# EAGLE design Nch_Full_Bridge (EAGLE 6.2)
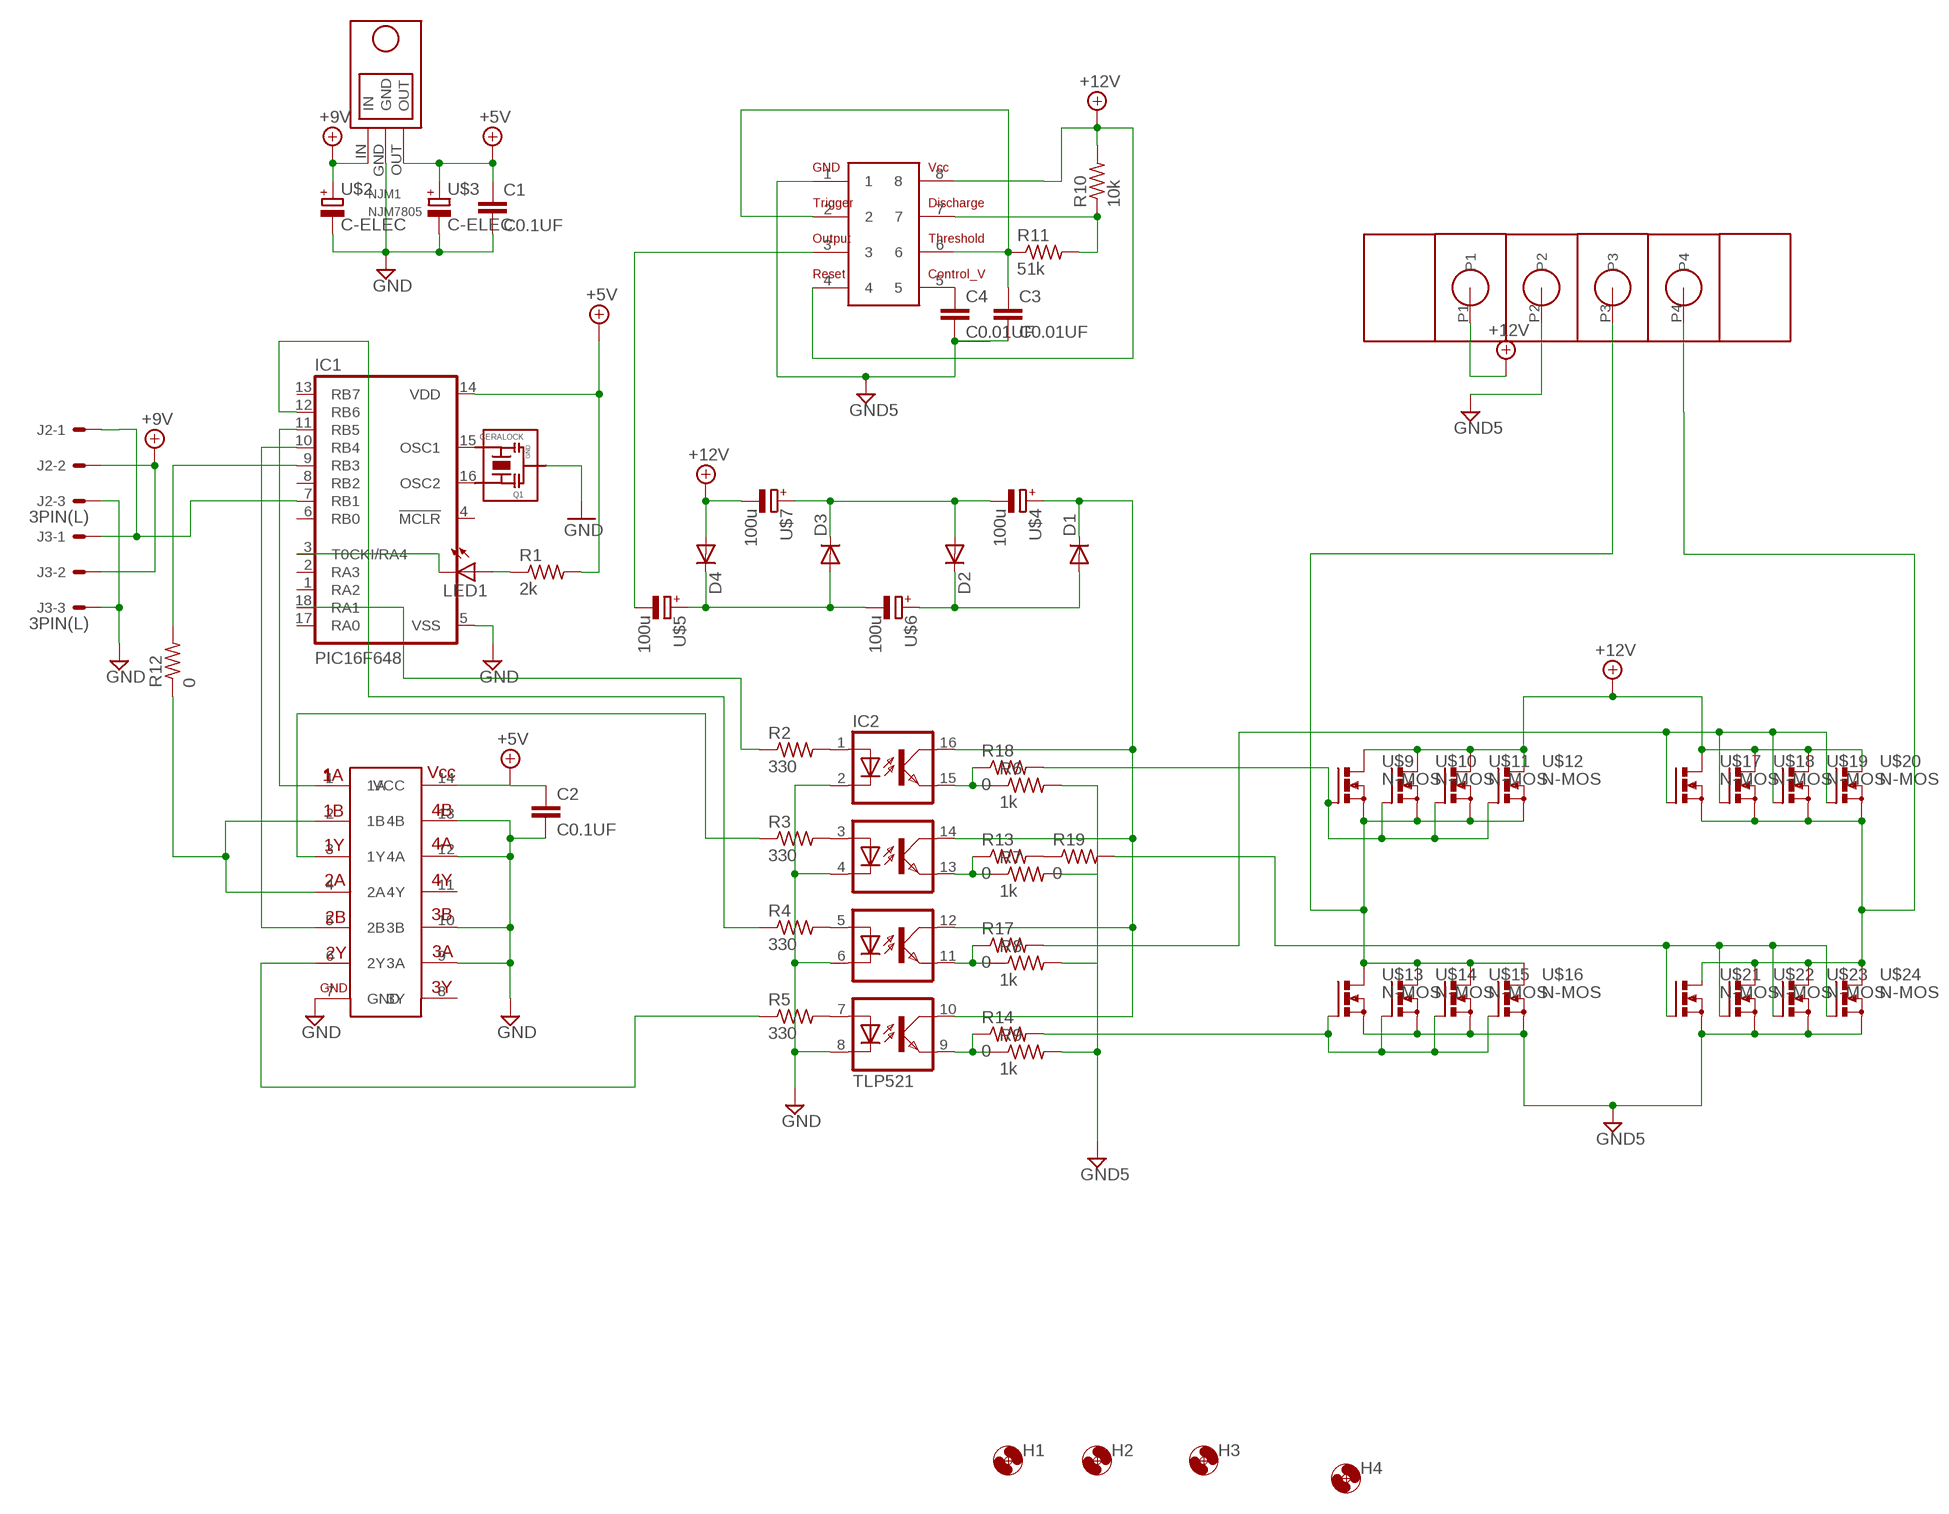
[diagram p0: schematic, sheet 1]

## Parts
C1  C0.1UF  [C0.1UF]
C2  C0.1UF  [C0.1UF]
C3  C0.01UF  C0.1UF  [C0.1UF]
C4  C0.01UF  C0.1UF  [C0.1UF]
D1  DIODE7.5  [DIODE7.5]
D2  DIODE7.5  [DIODE7.5]
D3  DIODE7.5  [DIODE7.5]
D4  DIODE7.5  [DIODE7.5]
H1  HOLE3.3M3BOLT  [HOLE3.3]
H2  HOLE3.3M3BOLT  [HOLE3.3]
H3  HOLE3.3M3BOLT  [HOLE3.3]
H4  HOLE3.3M3BOLT  [HOLE3.3]
IC1  PIC16F648  [DIL18]
IC2  TLP521  [DIL16]
J2  3PIN(L)  [3PL]
J3  3PIN(L)  [3PL]
LED1  LED  [LED5MM]
NJM1  NJM7805  [NJM7805]
Q1  CERALOCK  [CERALOCK]
R1  2k  R-  [0207/10]
R2  330  R-  [0207/10]
R3  330  R-  [0207/10]
R4  330  R-  [0207/10]
R5  330  R-  [0207/10]
R6  1k  R-  [0207/10]
R7  1k  R-  [0207/10]
R8  1k  R-  [0207/10]
R9  1k  R-  [0207/10]
R10  10k  R-  [0207/10]
R11  51k  R-  [0207/10]
R12  0  R-  [0207/10]
R13  0  R-  [0207/10]
R14  0  R-  [0207/10]
R17  0  R-  [0207/10]
R18  0  R-  [0207/10]
R19  0  R-  [0207/10]
U$1  HD74HC08  [DIL14]
U$2  C-ELEC  [C-6MM]
U$3  C-ELEC  [C-6MM]
U$4  100u  C-ELEC  [C-6MM]
U$5  100u  C-ELEC  [C-6MM]
U$6  100u  C-ELEC  [C-6MM]
U$7  100u  C-ELEC  [C-6MM]
U$8  NE555N  [DIL08]
U$9  N-MOS  [TO220BV]
U$10  N-MOS  [TO220BV]
U$11  N-MOS  [TO220BV]
U$12  N-MOS  [TO220BV]
U$13  N-MOS  [TO220BV]
U$14  N-MOS  [TO220BV]
U$15  N-MOS  [TO220BV]
U$16  N-MOS  [TO220BV]
U$17  N-MOS  [TO220BV]
U$18  N-MOS  [TO220BV]
U$19  N-MOS  [TO220BV]
U$20  N-MOS  [TO220BV]
U$21  N-MOS  [TO220BV]
U$22  N-MOS  [TO220BV]
U$23  N-MOS  [TO220BV]
U$24  N-MOS  [TO220BV]
U$25  BP341L  [BP341L]

## Nets
+5V: C1.1 C2.1 IC1.14(VDD) NJM1.OUT R1.2 U$1.14(VCC) U$3.+
+9V: J2.2 J3.2 NJM1.IN U$2.+
+12V: D4.PA(A) R10.2 U$7.- U$8.4 U$8.8 U$9.D U$10.D U$11.D U$12.D U$17.D U$18.D U$19.D U$25.P1
GND: C1.2 C2.2 IC1.5(VSS) IC2.2(C0) IC2.4(C1) IC2.6(C2) IC2.8(C3) J2.3 J3.3 NJM1.GND Q1.P$2 U$1.7(GND) U$1.9(3A) U$1.10(3B) U$1.12(4A) U$1.13(4B) U$2.- U$3.-
GND5: C3.2 C4.2 R6.2 R7.2 R8.2 R9.2 U$8.1 U$13.S U$14.S U$15.S U$16.S U$21.S U$22.S U$23.S U$24.S U$25.P2
N$1: IC1.16(OSC2) Q1.P$1
N$2: IC1.15(OSC1) Q1.P$3
N$3: IC1.3(T0CKI/RA4) LED1.K(C)
N$4: LED1.A R1.1
N$5: IC2.7(A3) R5.2
N$6: IC1.9(RB3) R12.2
N$7: IC1.18(RA1) R2.1
N$9: IC1.12(RB6) R4.1
N$10: R3.1 U$1.3(1Y)
N$11: R5.1 U$1.6(2Y)
N$12: R12.1 U$1.2(1B) U$1.4(2A)
N$13: IC1.11(RB5) U$1.1(1A)
N$14: IC1.10(RB4) U$1.5(2B)
N$15: IC2.1(A0) R2.2
N$16: IC2.3(A1) R3.2
N$17: IC2.5(A2) R4.2
N$18: R10.1 R11.2 U$8.7
N$19: D1.PK(C) IC2.10(COL3) IC2.12(COL2) IC2.14(COL1) IC2.16(COL0) U$4.+
N$20: D1.PA(A) D2.PK(C) U$6.+
N$21: D2.PA(A) D3.PK(C) U$4.- U$7.+
N$22: C3.1 R11.1 U$8.2 U$8.6
N$23: D3.PA(A) D4.PK(C) U$5.+ U$6.-
N$24: C4.1 U$8.5
N$26: U$5.- U$8.3
N$27: R18.2 U$9.G U$10.G U$11.G U$12.G
N$28: R19.2 U$21.G U$22.G U$23.G U$24.G
N$29: R17.2 U$17.G U$18.G U$19.G U$20.G
N$30: R14.2 U$13.G U$14.G U$15.G U$16.G
N$31: IC2.11(EMIT2) R8.1 R17.1
N$32: U$9.S U$10.S U$11.S U$12.S U$13.D U$14.D U$15.D U$16.D U$25.P3
N$33: IC1.7(RB1) J2.1 J3.1
N$34: IC2.13(EMIT1) R7.1 R13.1
N$35: IC2.9(EMIT3) R9.1 R14.1
N$38: IC2.15(EMIT0) R6.1 R18.1
N$39: U$17.S U$18.S U$19.S U$20.S U$22.D U$23.D U$24.D U$25.P4
N$40: R13.2 R19.1
Unconnected: IC1.1(RA2) IC1.2(RA3) IC1.4(!MCLR) IC1.6(RB0) IC1.8(RB2) IC1.13(RB7) IC1.17(RA0) U$1.8(3Y) U$1.11(4Y) U$20.D U$21.D

## Library data of the parts
C1-C4 = FP-21T for MITS:C0.1UF
D1-D4 = diode:DIODE7.5
H1-H4 = FP-21T for MITS:HOLE3.3
IC1 = FP-21T for MITS:PIC16F648
IC2 = FP-21T for MITS:TLP521
J2 J3 = my_connector:3PIN(L)
LED1 = my_led:LED: LED
NJM1 = My_NJM7805:NJM7805
Q1 = FP-21T for MITS:CERALOCK: CERALOCK CERAMIC RESONATOR
R1-R14 R17-R19 = My_rcl:R-: Resistor
U$1 = IC:HD74HC08
U$2-U$7 = My_rcl:C-ELEC
U$8 = IC:NE555N
U$9-U$24 = FET_kai:N-MOS
U$25 = BP341_4PIN:BP341L

## Board
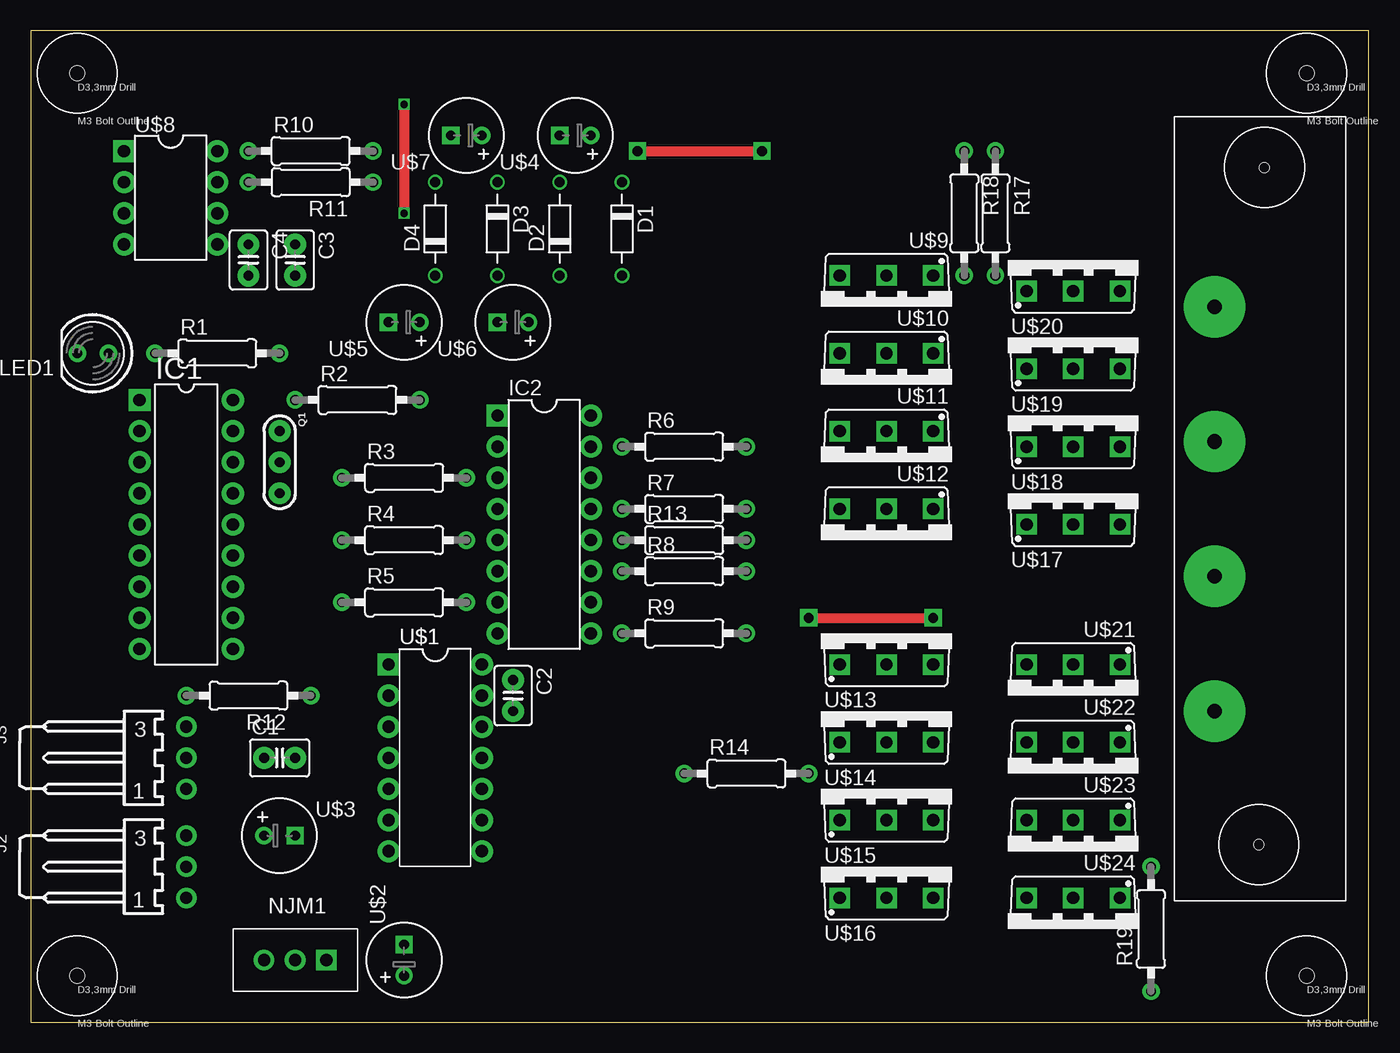
[diagram p1: board, top side]
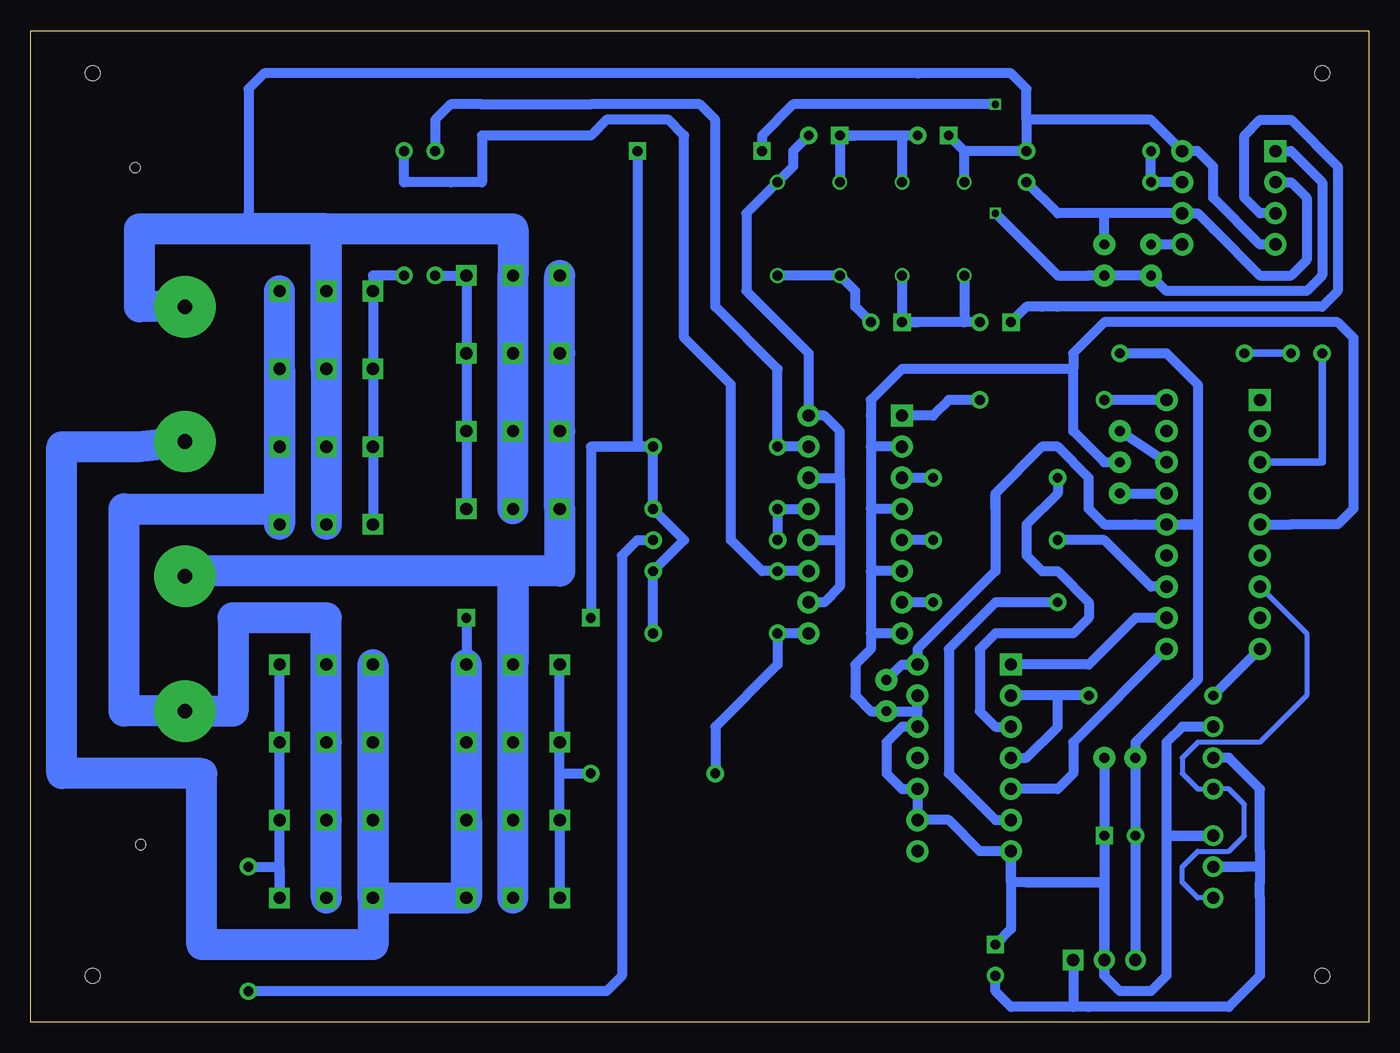
[diagram p2: board, bottom side, seen from below]

Size 109.2 x 80.95 mm. Coordinates in mm from the lower left corner, seen from the top.
Outline: 0,0 109.2,0 109.2,80.95 0,80.95 0,0
Copper layers (1*16): Top 0.035mm / dielectric 1.5mm / Bottom 0.035mm
Design rules: minimum track width 0.15mm, minimum drill 0.3mm, track to track 0.15mm, track to pad 0.15mm, pad to pad 0.15mm, via to via 0.15mm, smd to smd 0.15mm, copper to edge 0.7mm, drill to drill 0.45mm, minimum pad ring 0.15mm, minimum via ring 0.15mm, stop-mask expansion 4mil, vias tented up to drill 0mil, thermal gap 0.15mm

### Footprints (pad centres in the part's own frame; a part is rotated, then mirrored left to right if it is on the bottom)
C0.1UF = drill 0.8 pad 1.778: 1 -1.27,0; 2 1.27,0
DIODE7.5 = drill 0.8: PA 3.81,0; PK -3.81,0
HOLE3.3 = hole 1.2: 0,0
DIL18 = drill 1 pad 1.8 square: 1 -10.16,-3.81 | drill 1 pad 1.8: 2 -7.62,-3.81; 3 -5.08,-3.81; 4 -2.54,-3.81; 5 0,-3.81; 6 2.54,-3.81; 7 5.08,-3.81; 8 7.62,-3.81; 9 10.16,-3.81; 10 10.16,3.81; 11 7.62,3.81; 12 5.08,3.81; 13 2.54,3.81; 14 0,3.81; 15 -2.54,3.81; 16 -5.08,3.81; 17 -7.62,3.81; 18 -10.16,3.81
DIL16 = drill 1 pad 1.8 square: 1 -8.89,-3.81 | drill 1 pad 1.8: 2 -6.35,-3.81; 3 -3.81,-3.81; 4 -1.27,-3.81; 5 1.27,-3.81; 6 3.81,-3.81; 7 6.35,-3.81; 8 8.89,-3.81; 9 8.89,3.81; 10 6.35,3.81; 11 3.81,3.81; 12 1.27,3.81; 13 -1.27,3.81; 14 -3.81,3.81; 15 -6.35,3.81; 16 -8.89,3.81
3PL = drill 1 pad 1.676: 1 -2.54,-7.62; 2 0,-7.62; 3 2.54,-7.62
LED5MM = drill 0.8 pad 1.422: A -1.27,0; K 1.27,0
NJM7805 = drill 1 pad 1.676: GND 0,0; OUT 2.54,0 | drill 1 pad 1.676 square: IN -2.54,0
CERALOCK = drill 0.8 pad 1.778: P$1 -2.54,0; P$2 0,0; P$3 2.54,0
0207/10 = drill 0.8 pad 1.422: 1 -5.08,0; 2 5.08,0
DIL14 = drill 1 pad 1.8 square: 1 -7.62,-3.81 | drill 1 pad 1.8: 2 -5.08,-3.81; 3 -2.54,-3.81; 4 0,-3.81; 5 2.54,-3.81; 6 5.08,-3.81; 7 7.62,-3.81; 8 7.62,3.81; 9 5.08,3.81; 10 2.54,3.81; 11 0,3.81; 12 -2.54,3.81; 13 -5.08,3.81; 14 -7.62,3.81
C-6MM = drill 0.8 pad 1.422: + -1.27,0 | drill 0.8 pad 1.422 square: - 1.27,0
DIL08 = drill 1 pad 1.8 square: 1 -3.81,-3.81 | drill 1 pad 1.8: 2 -1.27,-3.81; 3 1.27,-3.81; 4 3.81,-3.81; 5 3.81,3.81; 6 1.27,3.81; 7 -1.27,3.81; 8 -3.81,3.81
TO220BV = drill 1 pad 1.676 square: D 0,0; G -3.81,0; S 3.81,0
BP341L = drill 1.2 pad 5: P1 -16.5,-3.7; P2 -5.5,-3.7; P3 5.5,-3.7; P4 16.5,-3.7 | hole 0.8: -27.87,0.37; 27.4,-0.1

### Placement (x,y rotation side)
C1  20.32,21.59 0 top
C2  39.37,26.67 270 top
C3  21.59,62.23 270 top
C4  17.78,62.23 270 top
D1  48.26,64.77 270 top
D2  43.18,64.77 90 top
D3  38.1,64.77 270 top
D4  33.02,64.77 90 top
H1  3.81,3.81 0 top
H2  3.81,77.47 0 top
H3  104.14,3.81 0 top
H4  104.14,77.47 0 top
IC1  12.7,40.64 270 top
IC2  41.91,40.64 270 top
J2  5.08,12.7 90 top
J3  5.08,21.59 90 top
LED1  5.08,54.61 180 top
NJM1  21.59,5.08 180 top
Q1  20.32,45.72 270 top
R1  15.24,54.61 0 top
R2  26.67,50.8 0 top
R3  30.48,44.45 0 top
R4  30.48,39.37 0 top
R5  30.48,34.29 0 top
R6  53.34,46.99 0 top
R7  53.34,41.91 0 top
R8  53.34,36.83 0 top
R9  53.34,31.75 0 top
R10  22.86,71.12 0 top
R11  22.86,68.58 180 top
R12  17.78,26.67 180 top
R13  53.34,39.37 0 top
R14  58.42,20.32 0 top
R17  78.74,66.04 270 top
R18  76.2,66.04 270 top
R19  91.44,7.62 90 top
U$1  33.02,21.59 270 top
U$2  30.48,5.08 90 top
U$3  20.32,15.24 0 top
U$4  44.45,72.39 180 top
U$5  30.48,57.15 180 top
U$6  39.37,57.15 180 top
U$7  35.56,72.39 180 top
U$8  11.43,67.31 270 top
U$9  69.85,60.96 180 top
U$10  69.85,54.61 180 top
U$11  69.85,48.26 180 top
U$12  69.85,41.91 180 top
U$13  69.85,29.21 0 top
U$14  69.85,22.86 0 top
U$15  69.85,16.51 0 top
U$16  69.85,10.16 0 top
U$17  85.09,40.64 0 top
U$18  85.09,46.99 0 top
U$19  85.09,53.34 0 top
U$20  85.09,59.69 0 top
U$21  85.09,29.21 180 top
U$22  85.09,22.86 180 top
U$23  85.09,16.51 180 top
U$24  85.09,10.16 180 top
U$25  100.33,41.91 270 top

### Tracks (layer width: path | path; a pad name or v marks a point on that pad's centre or on a via)
+5V
  Bottom 0.61: 15.24,40.64 IC1.14
  Bottom 0.813: R1.2 16.51,54.61 13.97,52.07 13.97,40.64 | 13.97,40.64 15.24,40.64 | 15.24,40.64 IC1.14 19.05,40.64 21.59,40.64 22.86,41.91 | 15.24,40.64 13.97,40.64 | 13.97,40.64 13.97,27.94 19.05,22.86 C1.1 U$3.+ 19.05,7.62 NJM1.OUT | 22.86,41.91 22.86,44.45 | 22.86,44.45 25.4,46.99 | 25.4,46.99 26.67,46.99 | 22.86,41.91 22.86,44.45 | 22.86,44.45 25.4,46.99 | 25.4,46.99 26.67,46.99 | 30.48,41.91 30.48,43.18 | 30.48,43.18 26.67,46.99 | 26.67,46.99 30.48,43.18 | 30.48,43.18 30.48,36.83 36.83,30.48 U$1.14 38.1,29.21 C2.1
+9V
  Bottom 0.813: 10.16,12.7 J2.2 10.16,12.7 | 8.89,13.97 8.89,19.05 11.43,21.59 J3.2 | 8.89,13.97 8.89,12.7 | 8.89,12.7 8.89,11.43 8.89,10.16 8.89,3.81 11.43,1.27 22.86,1.27 24.13,1.27 | 8.89,13.97 8.89,12.7 | 8.89,12.7 10.16,12.7 | NJM1.IN 24.13,1.27 | 24.13,1.27 29.21,1.27 30.48,2.54 U$2.+
+12V
  Bottom 0.813: U$9.D 69.85,64.77 85.09,64.77 91.44,64.77 91.44,66.04 91.44,76.2 90.17,77.47 36.83,77.47 29.21,77.47 27.94,76.2 27.94,73.66 | 27.94,73.66 R10.2 33.02,71.12 | 27.94,73.66 17.78,73.66 U$8.8 13.97,71.12 12.7,69.85 12.7,67.31 8.89,63.5 U$8.4 | D4.PA 33.02,69.85 33.02,71.12 | 33.02,71.12 U$7.-
  Bottom 2.54: U$12.D U$11.D U$10.D U$9.D 69.85,64.77 85.09,64.77 | U$19.D U$18.D | U$18.D U$17.D U$18.D | U$19.D U$18.D | U$25.P1 100.33,58.41 100.33,64.77 91.44,64.77 | 91.44,64.77 85.09,64.77 | 85.09,64.77 U$19.D | U$19.D 85.09,64.77 | 85.09,64.77 91.44,64.77 | 91.44,64.77 85.09,64.77
GND
  Bottom 0.813: IC1.5 6.35,40.64 2.54,40.64 1.27,41.91 1.27,55.88 2.54,57.15 21.59,57.15 24.13,54.61 24.13,53.34 | Q1.P$2 21.59,45.72 24.13,48.26 24.13,53.34 | 40.64,46.99 40.64,49.53 40.64,50.8 38.1,53.34 24.13,53.34 | 40.64,46.99 40.64,41.91 | 40.64,41.91 40.64,36.83 | 40.64,36.83 40.64,31.75 | IC2.8 40.64,31.75 | IC2.6 40.64,36.83 | IC2.4 40.64,41.91 | IC2.2 40.64,46.99 | 27.94,11.43 21.59,11.43 | J3.3 15.24,24.13 16.51,22.86 16.51,15.24 | 16.51,15.24 J2.3 16.51,15.24 | 16.51,15.24 16.51,3.81 17.78,2.54 20.32,2.54 21.59,3.81 | U$1.7 29.21,12.7 | 29.21,12.7 U$1.7 | U$1.7 31.75,13.97 34.29,16.51 U$1.9 U$1.10 38.1,19.05 39.37,20.32 39.37,22.86 38.1,24.13 U$1.12 36.83,25.4 | 40.64,31.75 40.64,30.48 41.91,29.21 41.91,26.67 40.64,25.4 C2.2 36.83,25.4 | 36.83,25.4 U$1.13 | 27.94,11.43 29.21,11.43 | 29.21,11.43 29.21,12.7 | 27.94,11.43 29.21,11.43 | 29.21,11.43 29.21,7.62 | 29.21,7.62 U$2.- | 29.21,12.7 29.21,7.62 | 29.21,7.62 U$2.- | 21.59,3.81 NJM1.GND | NJM1.GND 21.59,7.62 | 21.59,7.62 21.59,11.43 | 21.59,3.81 NJM1.GND | NJM1.GND 21.59,7.62 | 21.59,7.62 21.59,11.43 | 21.59,11.43 21.59,7.62 | 21.59,7.62 21.59,11.43 | C1.2 U$3.- 21.59,11.43 | 21.59,11.43 29.21,11.43 | 29.21,11.43 29.21,7.62 | 29.21,7.62 U$2.- | 21.59,11.43 21.59,8.89 | 21.59,8.89 NJM1.GND | NJM1.GND 21.59,3.81 | NJM1.GND 21.59,8.89
GND5  (via drill 0.6, 0.8 pad 1.42)
  Top 0.813: v49.53,71.12 v59.69,71.12 | v63.5,33.02 v73.66,33.02 | v30.48,74.93 v30.48,66.04
  Bottom 0.813: R8.2 R9.2 R8.2 | R8.2 55.88,39.37 | 55.88,39.37 R7.2 | R7.2 R6.2 | 63.5,46.99 59.69,46.99 | 59.69,46.99 R6.2 | C4.2 C3.2 | C4.2 C3.2 | U$8.1 6.35,71.12 3.81,68.58 3.81,60.96 5.08,59.69 16.51,59.69 C4.2 | C3.2 22.86,60.96 25.4,60.96 v30.48,66.04 | v30.48,74.93 46.99,74.93 49.53,72.39 v49.53,71.12 | R8.2 55.88,39.37 | 55.88,39.37 R7.2 | R7.2 R6.2 | R6.2 59.69,46.99 | 59.69,46.99 63.5,46.99 | 63.5,46.99 v63.5,33.02 | v59.69,71.12 59.69,46.99 | v73.66,33.02 U$13.S
  Bottom 2.54: U$16.S U$15.S | U$15.S U$14.S | U$14.S U$13.S U$14.S | U$15.S U$16.S | U$24.S U$23.S U$22.S U$21.S | U$21.S U$24.S | U$24.S U$16.S | U$21.S 81.28,6.35 95.25,6.35 95.25,20.32 106.68,20.32 106.68,46.99 100.44,46.99 U$25.P2
N$1
  Bottom 0.813: IC1.16 Q1.P$1
N$2
  Bottom 0.813: Q1.P$3 IC1.15
N$3
  Bottom 0.61: IC1.3 6.35,45.72 3.81,45.72 LED1.K
N$4
  Bottom 0.61: LED1.A R1.1
N$5
  Bottom 0.813: R5.2 IC2.7
N$6
  Bottom 0.813: IC1.9 R12.2
N$7
  Bottom 0.813: IC1.18 19.05,50.8 20.32,50.8 R2.1
N$9
  Bottom 0.813: IC1.12 17.78,35.56 21.59,39.37 R4.1
N$10
  Bottom 0.813: R3.1 25.4,43.18 27.94,40.64 27.94,38.1 26.67,36.83 25.4,36.83 22.86,34.29 22.86,33.02 24.13,31.75 30.48,31.75 31.75,30.48 31.75,25.4 30.48,24.13 U$1.3
N$11
  Bottom 0.813: R5.1 30.48,34.29 34.29,30.48 34.29,20.32 30.48,16.51 U$1.6
N$12
  Bottom 0.813: R12.1 25.4,26.67 | 25.4,26.67 U$1.2 | U$1.4 27.94,21.59 25.4,24.13 25.4,26.67
N$13
  Bottom 0.813: IC1.11 19.05,33.02 22.86,29.21 U$1.1
N$14
  Bottom 0.813: IC1.10 24.13,22.86 24.13,20.32 25.4,19.05 U$1.5
N$15
  Bottom 0.813: R2.2 34.29,50.8 35.56,49.53 IC2.1
N$16
  Bottom 0.813: R3.2 36.83,44.45 IC2.3
N$17
  Bottom 0.813: R4.2 IC2.5
N$18
  Bottom 0.813: U$8.7 R11.2 R10.1
N$19
  Bottom 0.813: 43.18,44.45 43.18,39.37 | IC2.14 43.18,44.45 | 43.18,39.37 IC2.12 43.18,39.37 | 43.18,44.45 43.18,48.26 44.45,49.53 IC2.16 45.72,54.61 50.8,59.69 50.8,66.04 D1.PK 46.99,69.85 46.99,71.12 U$4.+ | 43.18,39.37 43.18,35.56 44.45,34.29 IC2.10
N$20
  Bottom 0.813: D1.PA D2.PK 41.91,59.69 41.91,58.42 | 41.91,58.42 U$6.+ 41.91,58.42
N$21
  Bottom 0.813: 38.1,72.39 U$7.+ 38.1,72.39 | 38.1,72.39 41.91,72.39 | 41.91,72.39 U$4.- | U$4.- 41.91,72.39 | 38.1,72.39 D3.PK | 41.91,72.39 U$4.- | U$4.- D2.PA
N$22
  Bottom 0.813: U$8.2 6.35,68.58 5.08,67.31 5.08,62.23 6.35,60.96 8.89,60.96 12.7,64.77 13.97,66.04 U$8.6 21.59,66.04 | 21.59,66.04 25.4,66.04 R11.1 | C3.1 21.59,66.04
N$23
  Bottom 0.813: U$5.+ 33.02,57.15 | 33.02,57.15 36.83,57.15 | 36.83,57.15 U$6.- | U$6.- 36.83,57.15 | D4.PK 33.02,57.15 | D3.PA U$6.-
N$24
  Bottom 0.813: U$8.5 C4.1
N$26
  Bottom 0.813: U$8.3 8.89,66.04 10.16,67.31 10.16,72.39 8.89,73.66 6.35,73.66 2.54,69.85 2.54,59.69 3.81,58.42 25.4,58.42 26.67,58.42 27.94,58.42 U$5.-
N$27
  Bottom 0.813: R18.2 U$9.G U$10.G U$11.G U$12.G
N$28
  Bottom 0.813: R19.2 88.9,12.7 | 88.9,12.7 U$24.G 88.9,12.7 | 88.9,12.7 U$23.G U$22.G U$21.G
N$29
  Bottom 0.813: R17.2 81.28,60.96 U$20.G U$19.G U$18.G U$17.G
N$30
  Bottom 0.813: U$15.G 66.04,20.32 | 66.04,20.32 U$14.G U$13.G | U$15.G U$16.G | U$15.G 66.04,20.32 | 66.04,20.32 R14.2
N$31
  Bottom 0.813: IC2.11 R8.1 49.53,36.83 | 49.53,36.83 52.07,39.37 | R17.1 78.74,69.85 78.74,68.58 74.93,68.58 72.39,68.58 72.39,72.39 63.5,72.39 62.23,73.66 57.15,73.66 55.88,72.39 55.88,55.88 52.07,52.07 52.07,44.45 52.07,39.37 | 52.07,39.37 49.53,36.83 | 49.53,36.83 52.07,39.37
N$32
  Bottom 2.54: U$16.D U$15.D U$14.D 69.85,27.94 U$13.D | U$9.S U$10.S U$11.S U$12.S 66.04,36.83 69.85,36.83 | 69.85,36.83 U$13.D | U$13.D 69.85,36.83 | 69.85,36.83 94.94,36.83 U$25.P3
N$33
  Bottom 0.406: IC1.7 6.35,33.02 5.08,31.75 5.08,26.67 8.89,22.86 13.97,22.86 15.24,21.59 15.24,20.32 13.97,19.05 J3.1 11.43,19.05 10.16,17.78 10.16,15.24 11.43,13.97 13.97,13.97 15.24,12.7 15.24,11.43 13.97,10.16 J2.1
N$34
  Bottom 0.813: IC2.13 R7.1 48.26,40.64 R13.1
N$35
  Bottom 0.813: IC2.9 R9.1 48.26,29.21 53.34,24.13 R14.1
N$38
  Bottom 0.813: IC2.15 R6.1 48.26,53.34 53.34,58.42 53.34,72.39 53.34,73.66 54.61,74.93 63.5,74.93 72.39,74.93 74.93,74.93 76.2,73.66 R18.1
N$39
  Bottom 2.54: U$24.D U$23.D U$22.D 85.09,33.02 92.71,33.02 92.71,25.4 U$25.P4 101.6,25.41 101.6,41.91 88.9,41.91 | 88.9,41.91 U$17.S | 88.9,41.91 U$18.S | U$18.S U$19.S | U$19.S U$20.S | U$19.S U$18.S | U$18.S 88.9,41.91 | 88.9,41.91 U$17.S | 88.9,41.91 U$17.S
N$40
  Bottom 0.813: R13.2 59.69,39.37 60.96,38.1 60.96,3.81 62.23,2.54 R19.1